# EAGLE schematic LCMeter (EAGLE 6.1)

## Sheet 1 of 4
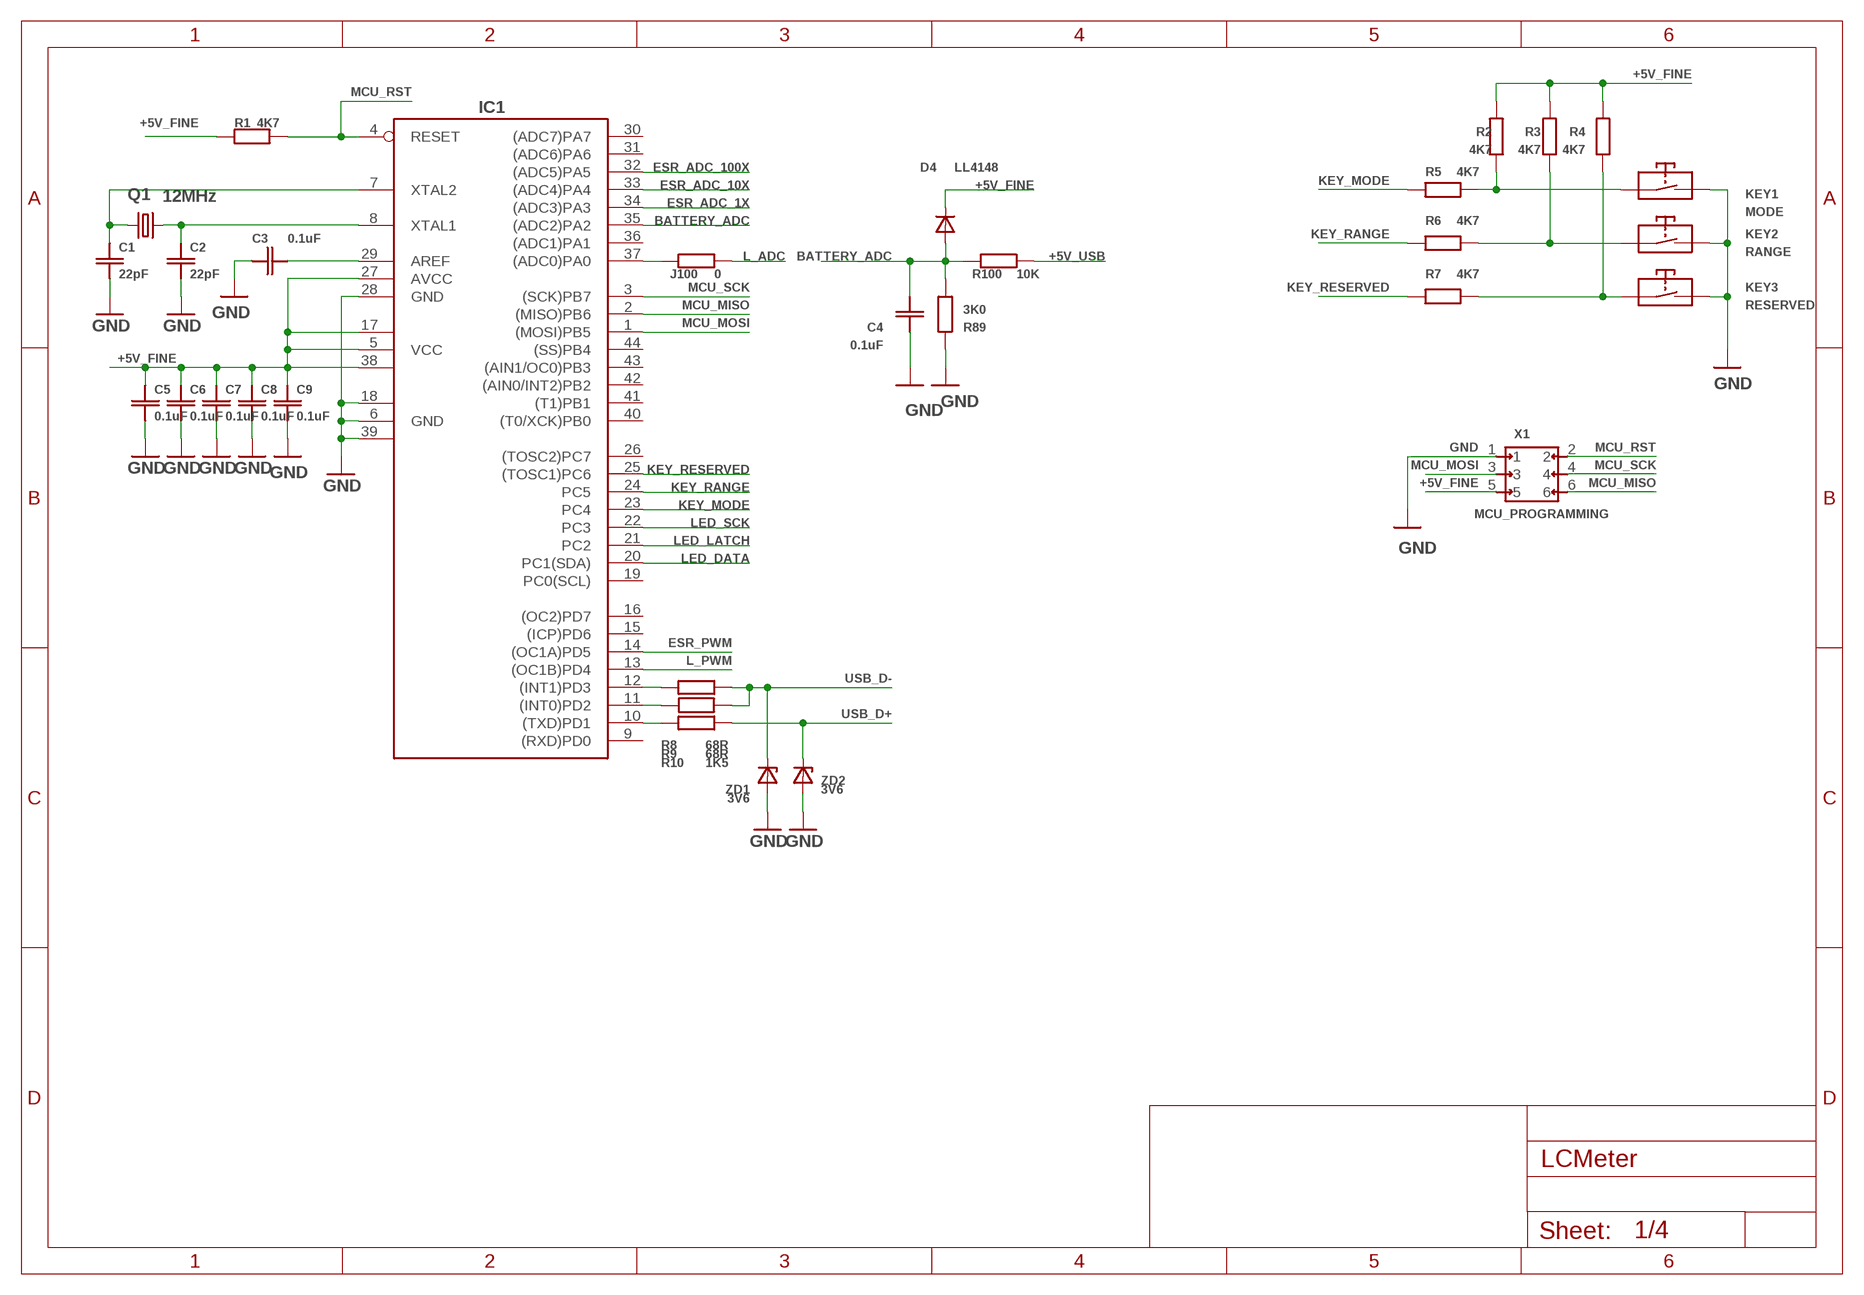
[diagram p0: schematic, sheet 1]

### Parts
C1  22pF  CSMD_0805  [RSMD_0805]
C2  22pF  CSMD_0805  [RSMD_0805]
C3  0.1uF  CSMD_0805  [RSMD_0805]
C4  0.1uF  CSMD_0805  [RSMD_0805]
C5  0.1uF  CSMD_0805  [RSMD_0805]
C6  0.1uF  CSMD_0805  [RSMD_0805]
C7  0.1uF  CSMD_0805  [RSMD_0805]
C8  0.1uF  CSMD_0805  [RSMD_0805]
C9  0.1uF  CSMD_0805  [RSMD_0805]
D4  LL4148  LL4147SOD-80  [SOD-80]
IC1  MEGA8535  MEGA8535-A  [TQFP44]
J100  0  RSMD_1206_BIG_GAP  [RSMD_1206_BIG_GAP]
KEY1  MODE  KEY(7X4.5)  [KEY_7X4.5]
KEY2  RANGE  KEY(7X4.5)  [KEY_7X4.5]
KEY3  RESERVED  KEY(7X4.5)  [KEY_7X4.5]
Q1  12MHz  CRYSTALHC49U-V  [HC49U-V]
R1  4K7  RSMD_0805  [RSMD_0805]
R2  4K7  RSMD_0805  [RSMD_0805]
R3  4K7  RSMD_0805  [RSMD_0805]
R4  4K7  RSMD_0805  [RSMD_0805]
R5  4K7  RSMD_0805  [RSMD_0805]
R6  4K7  RSMD_0805  [RSMD_0805]
R7  4K7  RSMD_0805  [RSMD_0805]
R8  68R  RSMD_0805  [RSMD_0805]
R9  1K5  RSMD_0805  [RSMD_0805]
R10  68R  RSMD_0805  [RSMD_0805]
R89  3K0  RSMD_0805  [RSMD_0805]
R100  10K  RSMD_0805  [RSMD_0805]
X1  MCU_PROGRAMMING  PIN2X32.54MM_LOOSE_PADS  [PIN2X3_2.54MM_LOOSE_PADS]
ZD1  3V6  ZENNER(SOD_80)  [SOD-80]
ZD2  3V6  ZENNER(SOD_80)  [SOD-80]

### Nets
+5V_FINE: C5.PAD_1(PIN1) C6.PAD_1(PIN1) C7.PAD_1(PIN1) C8.PAD_1(PIN1) C9.PAD_1(PIN1) D4.CATHODE IC1.5(VCC) IC1.17(VCC1) IC1.27(AVCC) IC1.38(VCC2) R1.PAD_0(PIN0) R2.PAD_1(PIN1) R3.PAD_1(PIN1) R4.PAD_1(PIN1) X1.5 ; also sheet 3,4
+5V_USB: R100.PAD_0(PIN0) ; also sheet 4
BATTERY_ADC: C4.PAD_1(PIN1) D4.ANODE IC1.35((ADC2)PA2) R89.PAD_0(PIN0) R100.PAD_1(PIN1)
ESR_ADC_1X: IC1.34((ADC3)PA3) ; also sheet 3
ESR_ADC_10X: IC1.33((ADC4)PA4) ; also sheet 3
ESR_ADC_100X: IC1.32((ADC5)PA5) ; also sheet 3
ESR_PWM: IC1.14((OC1A)PD5) ; also sheet 3
GND: C1.PAD_0(PIN0) C2.PAD_0(PIN0) C3.PAD_0(PIN0) C4.PAD_0(PIN0) C5.PAD_0(PIN0) C6.PAD_0(PIN0) C7.PAD_0(PIN0) C8.PAD_0(PIN0) C9.PAD_0(PIN0) IC1.6(GND) IC1.18(GND1) IC1.28(GND) IC1.39(GND2) KEY1.3 KEY1.4 KEY2.3 KEY2.4 KEY3.3 KEY3.4 R89.PAD_1(PIN1) X1.1 ZD1.ANODE ZD2.ANODE ; also sheet 2,3,4
KEY_MODE: IC1.23(PC4) R5.PAD_1(PIN1)
KEY_RANGE: IC1.24(PC5) R6.PAD_1(PIN1)
KEY_RESERVED: IC1.25((TOSC1)PC6) R7.PAD_1(PIN1)
L_ADC: J100.PAD_0(PIN0) ; also sheet 3
L_PWM: IC1.13((OC1B)PD4) ; also sheet 3
LED_DATA: IC1.20(PC1(SDA)) ; also sheet 2
LED_LATCH: IC1.21(PC2) ; also sheet 2
LED_SCK: IC1.22(PC3) ; also sheet 2
MCU_MISO: IC1.2((MISO)PB6) X1.6
MCU_MOSI: IC1.1((MOSI)PB5) X1.3
MCU_RST: IC1.4(RESET) R1.PAD_1(PIN1) X1.2
MCU_SCK: IC1.3((SCK)PB7) X1.4
N$7: IC1.10((TXD)PD1) R10.PAD_0(PIN0)
N$8: IC1.12((INT1)PD3) R8.PAD_1(PIN1)
N$100: IC1.37((ADC0)PA0) J100.PAD_1(PIN1)
N$110: C2.PAD_1(PIN1) IC1.8(XTAL1) Q1.2
N$111: C1.PAD_1(PIN1) IC1.7(XTAL2) Q1.1
N$112: IC1.11((INT0)PD2) R9.PAD_1(PIN1)
N$141: C3.PAD_1(PIN1) IC1.29(AREF)
N$144: KEY1.1 KEY1.2 R2.PAD_0(PIN0) R5.PAD_0(PIN0)
N$145: KEY2.1 KEY2.2 R3.PAD_0(PIN0) R6.PAD_0(PIN0)
N$146: KEY3.1 KEY3.2 R4.PAD_0(PIN0) R7.PAD_0(PIN0)
USB_D+: R10.PAD_1(PIN1) ZD2.CATHODE ; also sheet 4
USB_D-: R8.PAD_0(PIN0) R9.PAD_0(PIN0) ZD1.CATHODE ; also sheet 4
Unconnected: IC1.9((RXD)PD0) IC1.15((ICP)PD6) IC1.16((OC2)PD7) IC1.19(PC0(SCL)) IC1.26((TOSC2)PC7) IC1.30((ADC7)PA7) IC1.31((ADC6)PA6) IC1.36((ADC1)PA1) IC1.40((T0/XCK)PB0) IC1.41((T1)PB1) IC1.42((AIN0/INT2)PB2) IC1.43((AIN1/OC0)PB3) IC1.44((SS)PB4)

## Sheet 2 of 4
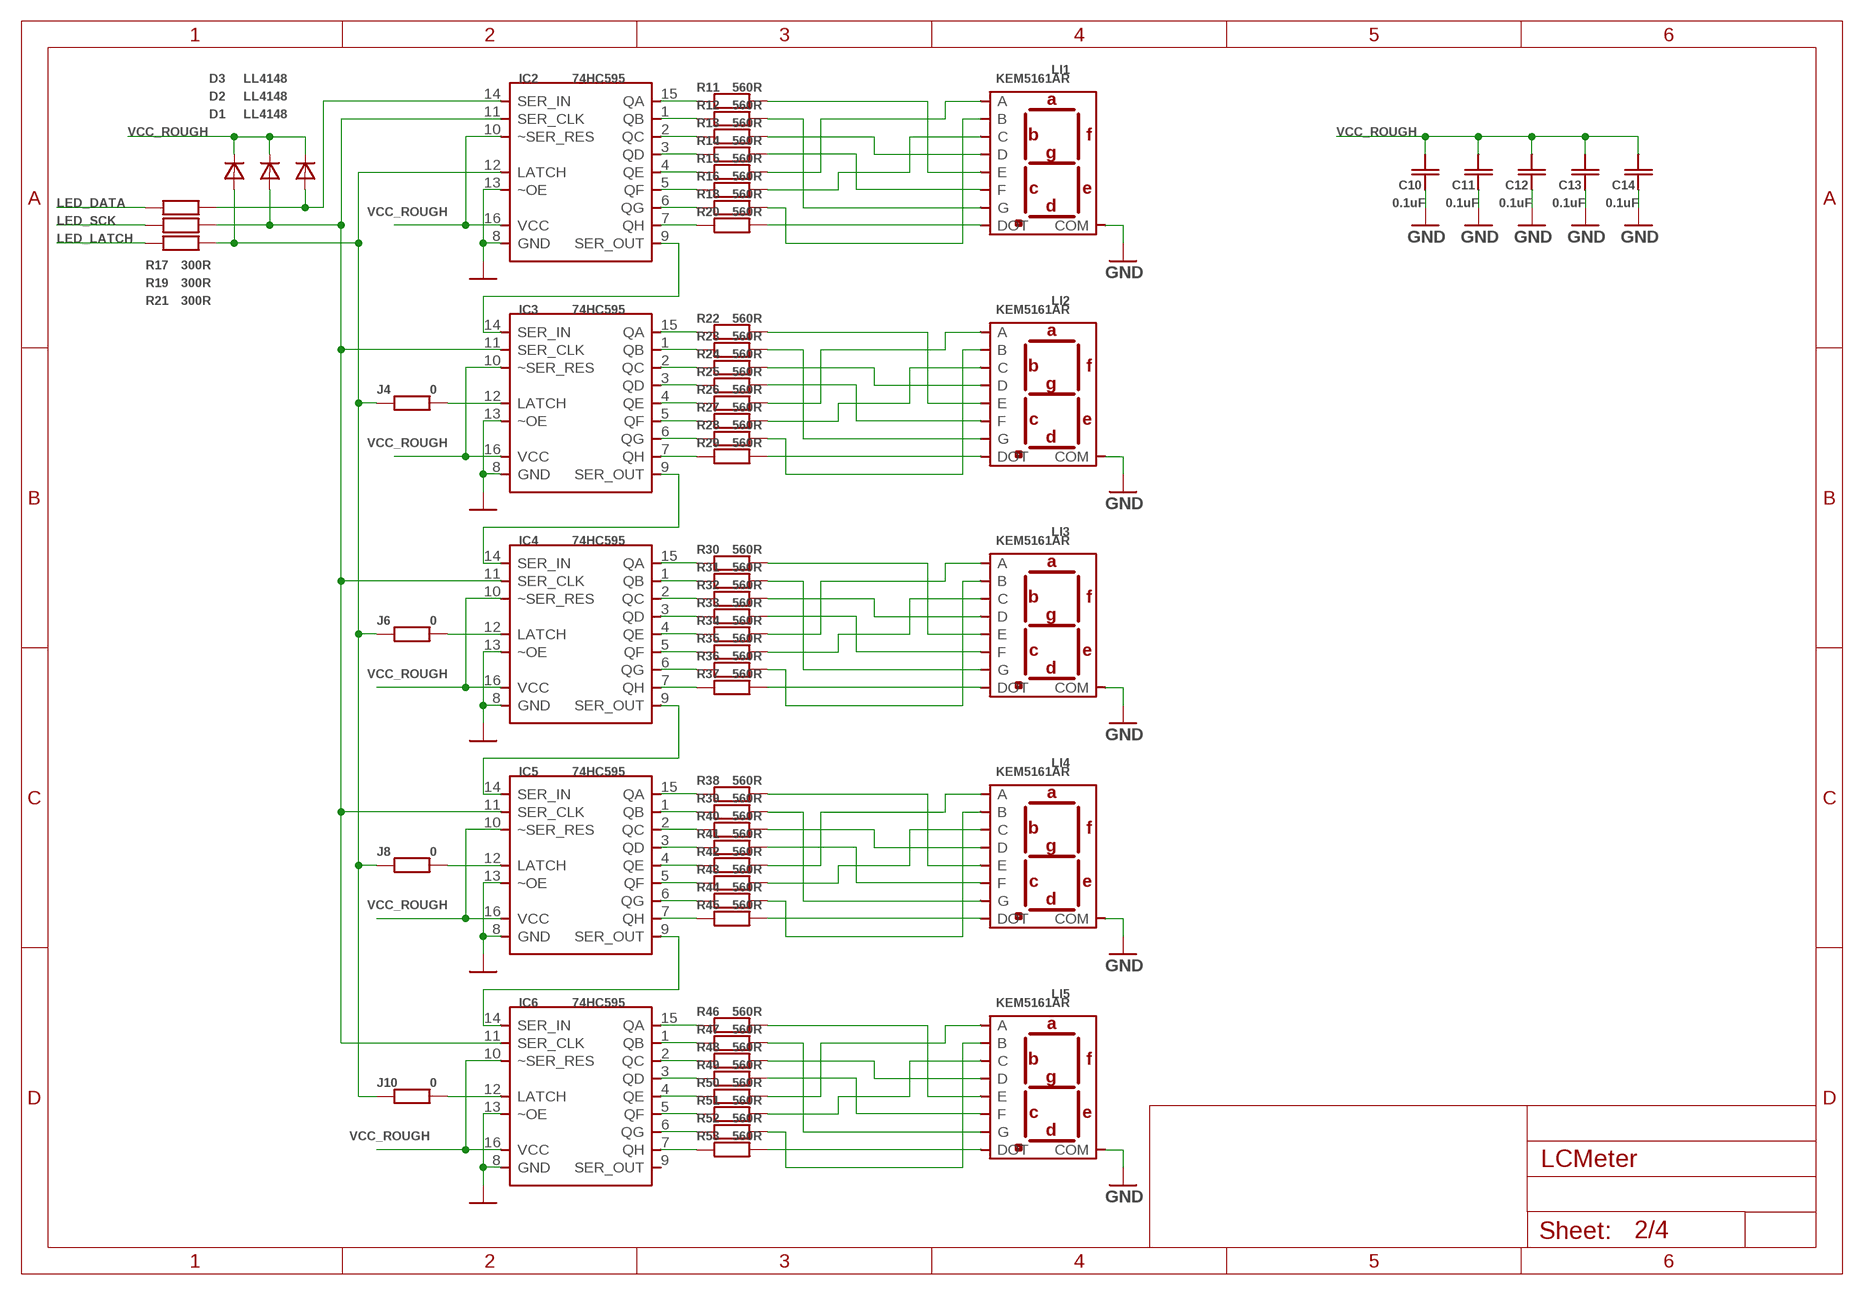
[diagram p1: schematic, sheet 2]

### Parts
C10  0.1uF  CSMD_0805  [RSMD_0805]
C11  0.1uF  CSMD_0805  [RSMD_0805]
C12  0.1uF  CSMD_0805  [RSMD_0805]
C13  0.1uF  CSMD_0805  [RSMD_0805]
C14  0.1uF  CSMD_0805  [RSMD_0805]
D1  LL4148  LL4147SOD-80  [SOD-80]
D2  LL4148  LL4147SOD-80  [SOD-80]
D3  LL4148  LL4147SOD-80  [SOD-80]
IC2  74HC595  74HC595(SOIC16)  [SOIC16]
IC3  74HC595  74HC595(SOIC16)  [SOIC16]
IC4  74HC595  74HC595(SOIC16)  [SOIC16]
IC5  74HC595  74HC595(SOIC16)  [SOIC16]
IC6  74HC595  74HC595(SOIC16)  [SOIC16]
J4  0  RSMD_0805  [RSMD_0805]
J6  0  RSMD_0805  [RSMD_0805]
J8  0  RSMD_0805  [RSMD_0805]
J10  0  RSMD_0805  [RSMD_0805]
LI1  KEM5161AR  KEM5161(NARROW)  [KEM-5161(NARROW)]
LI2  KEM5161AR  KEM5161(NARROW)  [KEM-5161(NARROW)]
LI3  KEM5161AR  KEM5161(NARROW)  [KEM-5161(NARROW)]
LI4  KEM5161AR  KEM5161(NARROW)  [KEM-5161(NARROW)]
LI5  KEM5161AR  KEM5161(NARROW)  [KEM-5161(NARROW)]
R11  560R  RSMD_0805  [RSMD_0805]
R12  560R  RSMD_0805  [RSMD_0805]
R13  560R  RSMD_0805  [RSMD_0805]
R14  560R  RSMD_0805  [RSMD_0805]
R15  560R  RSMD_0805  [RSMD_0805]
R16  560R  RSMD_0805  [RSMD_0805]
R17  300R  RSMD_0805  [RSMD_0805]
R18  560R  RSMD_0805  [RSMD_0805]
R19  300R  RSMD_0805  [RSMD_0805]
R20  560R  RSMD_0805  [RSMD_0805]
R21  300R  RSMD_0805  [RSMD_0805]
R22  560R  RSMD_0805  [RSMD_0805]
R23  560R  RSMD_0805  [RSMD_0805]
R24  560R  RSMD_0805  [RSMD_0805]
R25  560R  RSMD_0805  [RSMD_0805]
R26  560R  RSMD_0805  [RSMD_0805]
R27  560R  RSMD_0805  [RSMD_0805]
R28  560R  RSMD_0805  [RSMD_0805]
R29  560R  RSMD_0805  [RSMD_0805]
R30  560R  RSMD_0805  [RSMD_0805]
R31  560R  RSMD_0805  [RSMD_0805]
R32  560R  RSMD_0805  [RSMD_0805]
R33  560R  RSMD_0805  [RSMD_0805]
R34  560R  RSMD_0805  [RSMD_0805]
R35  560R  RSMD_0805  [RSMD_0805]
R36  560R  RSMD_0805  [RSMD_0805]
R37  560R  RSMD_0805  [RSMD_0805]
R38  560R  RSMD_0805  [RSMD_0805]
R39  560R  RSMD_0805  [RSMD_0805]
R40  560R  RSMD_0805  [RSMD_0805]
R41  560R  RSMD_0805  [RSMD_0805]
R42  560R  RSMD_0805  [RSMD_0805]
R43  560R  RSMD_0805  [RSMD_0805]
R44  560R  RSMD_0805  [RSMD_0805]
R45  560R  RSMD_0805  [RSMD_0805]
R46  560R  RSMD_0805  [RSMD_0805]
R47  560R  RSMD_0805  [RSMD_0805]
R48  560R  RSMD_0805  [RSMD_0805]
R49  560R  RSMD_0805  [RSMD_0805]
R50  560R  RSMD_0805  [RSMD_0805]
R51  560R  RSMD_0805  [RSMD_0805]
R52  560R  RSMD_0805  [RSMD_0805]
R53  560R  RSMD_0805  [RSMD_0805]

### Nets
GND: C10.PAD_0(PIN0) C11.PAD_0(PIN0) C12.PAD_0(PIN0) C13.PAD_0(PIN0) C14.PAD_0(PIN0) IC2.8(GND) IC2.13(~OE) IC3.8(GND) IC3.13(~OE) IC4.8(GND) IC4.13(~OE) IC5.8(GND) IC5.13(~OE) IC6.8(GND) IC6.13(~OE) LI1.3(COM) LI1.8(COM) LI2.3(COM) LI2.8(COM) LI3.3(COM) LI3.8(COM) LI4.3(COM) LI4.8(COM) LI5.3(COM) LI5.8(COM) ; also sheet 1,3,4
LED_DATA: R17.PAD_0(PIN0) ; also sheet 1
LED_DATA': D3.ANODE IC2.14(SER_IN) R17.PAD_1(PIN1)
LED_LATCH: R21.PAD_0(PIN0) ; also sheet 1
LED_LATCH': D1.ANODE IC2.12(LATCH) J4.PAD_0(PIN0) J6.PAD_0(PIN0) J8.PAD_0(PIN0) J10.PAD_0(PIN0) R21.PAD_1(PIN1)
LED_SCK: R19.PAD_0(PIN0) ; also sheet 1
LED_SCK': D2.ANODE IC2.11(SER_CLK) IC3.11(SER_CLK) IC4.11(SER_CLK) IC5.11(SER_CLK) IC6.11(SER_CLK) R19.PAD_1(PIN1)
N$14: IC3.15(QA) R22.PAD_0(PIN0)
N$15: IC3.1(QB) R23.PAD_0(PIN0)
N$16: IC3.2(QC) R24.PAD_0(PIN0)
N$17: IC3.3(QD) R25.PAD_0(PIN0)
N$18: IC3.4(QE) R26.PAD_0(PIN0)
N$19: LI1.1(E) R11.PAD_1(PIN1)
N$20: LI1.2(D) R13.PAD_1(PIN1)
N$21: LI1.4(C) R16.PAD_1(PIN1)
N$22: IC3.5(QF) R27.PAD_0(PIN0)
N$23: LI1.5(DOT) R20.PAD_1(PIN1)
N$24: LI1.10(G) R12.PAD_1(PIN1)
N$26: IC3.6(QG) R28.PAD_0(PIN0)
N$27: LI1.9(F) R14.PAD_1(PIN1)
N$28: LI1.7(A) R15.PAD_1(PIN1)
N$29: LI1.6(B) R18.PAD_1(PIN1)
N$30: IC2.15(QA) R11.PAD_0(PIN0)
N$31: IC2.1(QB) R12.PAD_0(PIN0)
N$32: IC2.2(QC) R13.PAD_0(PIN0)
N$33: IC2.3(QD) R14.PAD_0(PIN0)
N$34: IC2.4(QE) R15.PAD_0(PIN0)
N$35: IC2.5(QF) R16.PAD_0(PIN0)
N$36: IC2.6(QG) R18.PAD_0(PIN0)
N$37: IC2.7(QH) R20.PAD_0(PIN0)
N$38: IC3.7(QH) R29.PAD_0(PIN0)
N$40: LI2.1(E) R22.PAD_1(PIN1)
N$41: LI2.2(D) R24.PAD_1(PIN1)
N$42: LI2.4(C) R27.PAD_1(PIN1)
N$43: LI2.5(DOT) R29.PAD_1(PIN1)
N$44: LI2.10(G) R23.PAD_1(PIN1)
N$45: LI2.9(F) R25.PAD_1(PIN1)
N$46: LI2.7(A) R26.PAD_1(PIN1)
N$47: LI2.6(B) R28.PAD_1(PIN1)
N$48: IC4.15(QA) R30.PAD_0(PIN0)
N$49: IC4.1(QB) R31.PAD_0(PIN0)
N$50: IC4.2(QC) R32.PAD_0(PIN0)
N$51: IC4.3(QD) R33.PAD_0(PIN0)
N$52: IC4.4(QE) R34.PAD_0(PIN0)
N$53: IC4.5(QF) R35.PAD_0(PIN0)
N$54: IC4.6(QG) R36.PAD_0(PIN0)
N$55: IC4.7(QH) R37.PAD_0(PIN0)
N$56: LI3.1(E) R30.PAD_1(PIN1)
N$57: LI3.2(D) R32.PAD_1(PIN1)
N$58: LI3.4(C) R35.PAD_1(PIN1)
N$59: LI3.5(DOT) R37.PAD_1(PIN1)
N$60: LI3.10(G) R31.PAD_1(PIN1)
N$61: LI3.9(F) R33.PAD_1(PIN1)
N$62: LI3.7(A) R34.PAD_1(PIN1)
N$63: LI3.6(B) R36.PAD_1(PIN1)
N$64: IC5.15(QA) R38.PAD_0(PIN0)
N$65: IC5.1(QB) R39.PAD_0(PIN0)
N$66: IC5.2(QC) R40.PAD_0(PIN0)
N$67: IC5.3(QD) R41.PAD_0(PIN0)
N$68: IC5.4(QE) R42.PAD_0(PIN0)
N$69: IC5.5(QF) R43.PAD_0(PIN0)
N$70: IC5.6(QG) R44.PAD_0(PIN0)
N$71: IC5.7(QH) R45.PAD_0(PIN0)
N$72: LI4.1(E) R38.PAD_1(PIN1)
N$73: LI4.2(D) R40.PAD_1(PIN1)
N$74: LI4.4(C) R43.PAD_1(PIN1)
N$75: LI4.5(DOT) R45.PAD_1(PIN1)
N$76: LI4.10(G) R39.PAD_1(PIN1)
N$77: LI4.9(F) R41.PAD_1(PIN1)
N$78: LI4.7(A) R42.PAD_1(PIN1)
N$79: LI4.6(B) R44.PAD_1(PIN1)
N$80: IC6.15(QA) R46.PAD_0(PIN0)
N$81: IC6.1(QB) R47.PAD_0(PIN0)
N$82: IC6.2(QC) R48.PAD_0(PIN0)
N$83: IC6.3(QD) R49.PAD_0(PIN0)
N$84: IC6.4(QE) R50.PAD_0(PIN0)
N$85: IC6.5(QF) R51.PAD_0(PIN0)
N$86: IC6.6(QG) R52.PAD_0(PIN0)
N$87: IC6.7(QH) R53.PAD_0(PIN0)
N$88: LI5.1(E) R46.PAD_1(PIN1)
N$89: LI5.2(D) R48.PAD_1(PIN1)
N$90: LI5.4(C) R51.PAD_1(PIN1)
N$91: LI5.5(DOT) R53.PAD_1(PIN1)
N$92: LI5.10(G) R47.PAD_1(PIN1)
N$93: LI5.9(F) R49.PAD_1(PIN1)
N$94: LI5.7(A) R50.PAD_1(PIN1)
N$95: LI5.6(B) R52.PAD_1(PIN1)
N$96: IC4.9(SER_OUT) IC5.14(SER_IN)
N$97: IC3.9(SER_OUT) IC4.14(SER_IN)
N$98: IC2.9(SER_OUT) IC3.14(SER_IN)
N$99: IC5.9(SER_OUT) IC6.14(SER_IN)
N$103: IC3.12(LATCH) J4.PAD_1(PIN1)
N$107: IC6.12(LATCH) J10.PAD_1(PIN1)
N$108: IC5.12(LATCH) J8.PAD_1(PIN1)
N$109: IC4.12(LATCH) J6.PAD_1(PIN1)
VCC_ROUGH: C10.PAD_1(PIN1) C11.PAD_1(PIN1) C12.PAD_1(PIN1) C13.PAD_1(PIN1) C14.PAD_1(PIN1) D1.CATHODE D2.CATHODE D3.CATHODE IC2.10(~SER_RES) IC2.16(VCC) IC3.10(~SER_RES) IC3.16(VCC) IC4.10(~SER_RES) IC4.16(VCC) IC5.10(~SER_RES) IC5.16(VCC) IC6.10(~SER_RES) IC6.16(VCC) ; also sheet 4
Unconnected: IC6.9(SER_OUT)

## Sheet 3 of 4
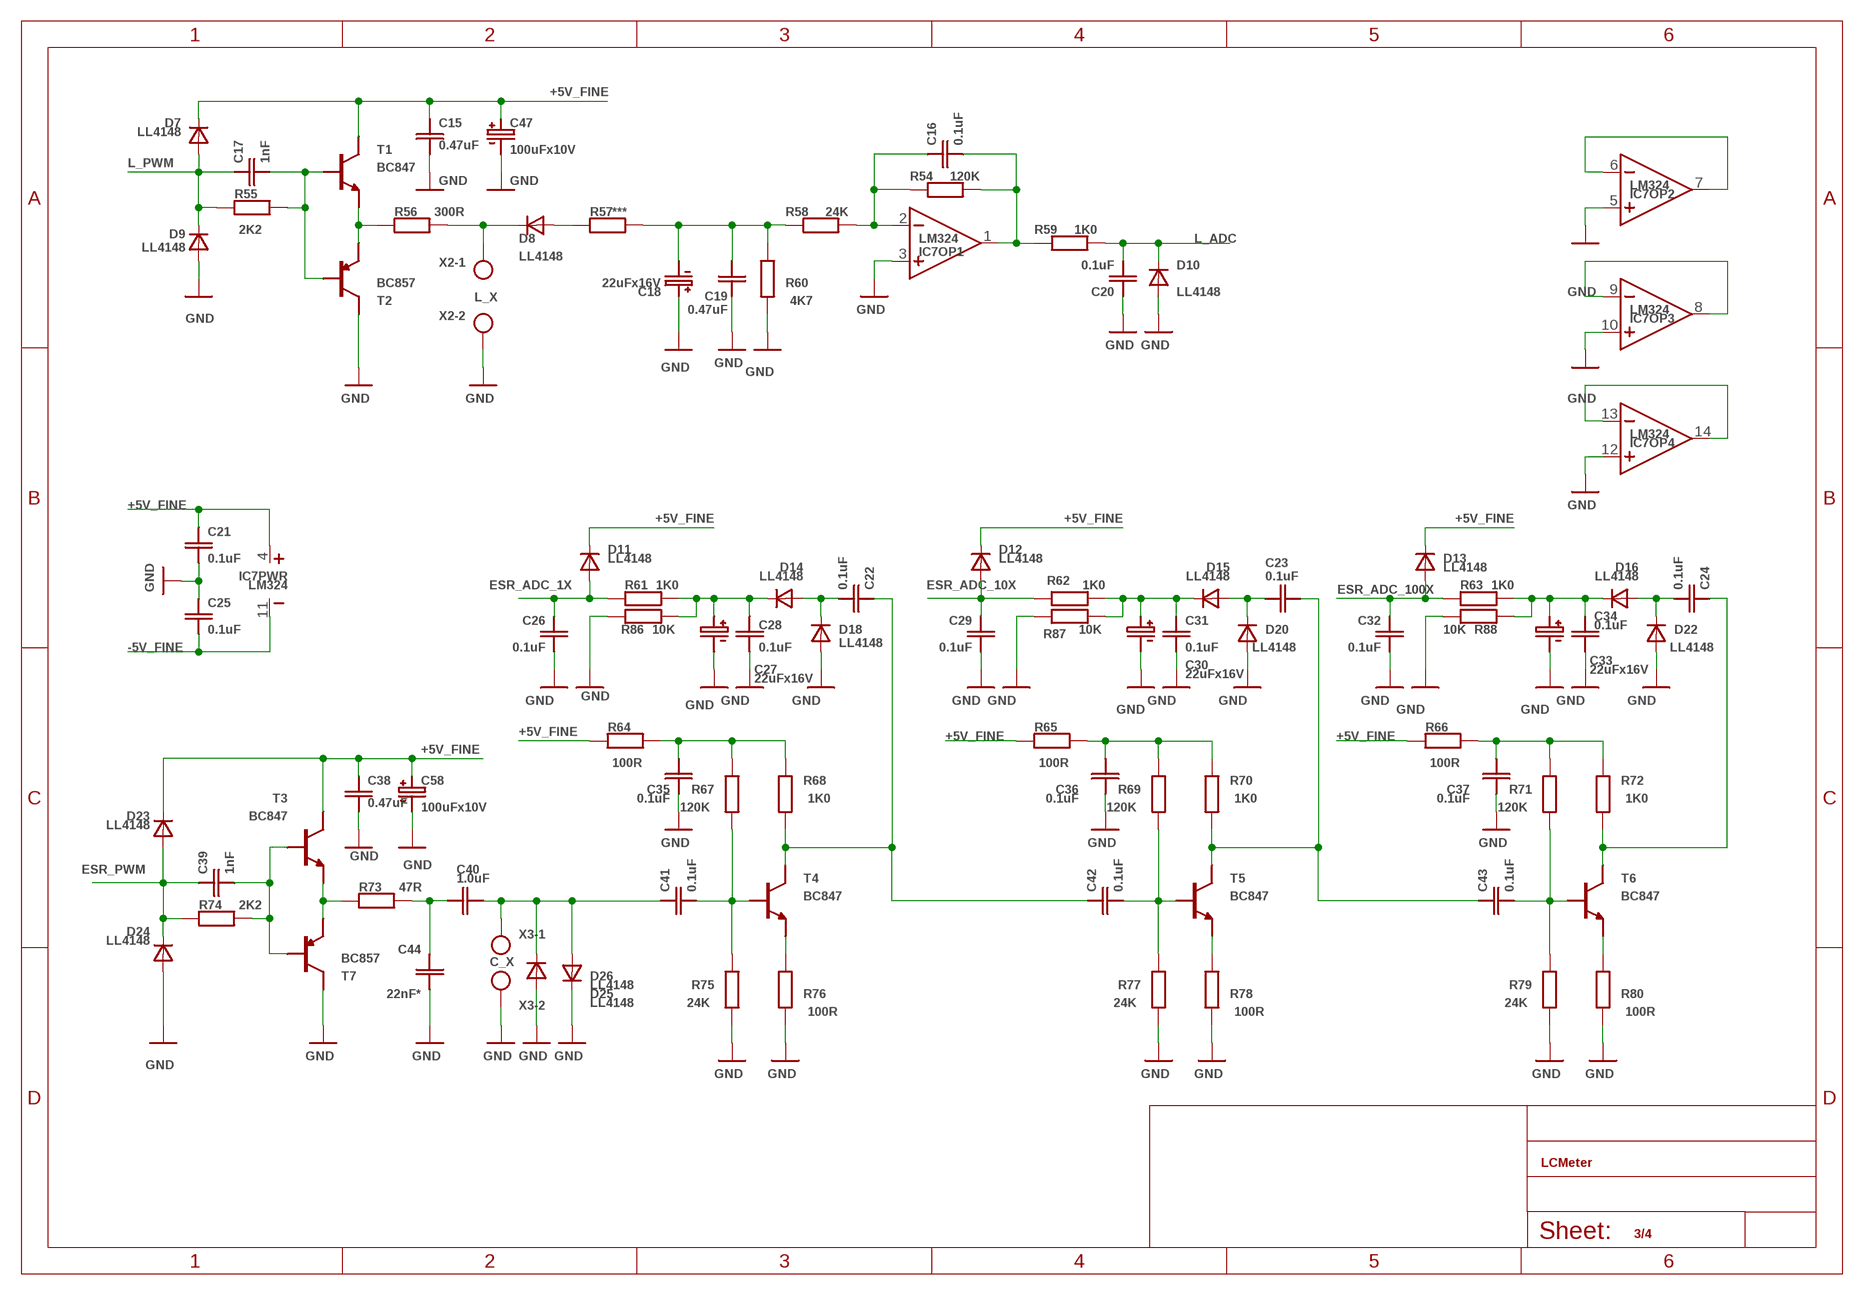
[diagram p2: schematic, sheet 3]

### Parts
C15  0.47uF  CSMD_0805  [RSMD_0805]
C16  0.1uF  CSMD_0805  [RSMD_0805]
C17  1nF  CSMD_0805  [RSMD_0805]
C18  22uFx16V  CE6.3MM  [CE_6.3MM]
C19  0.47uF  CSMD_1206_BIG_GAP  [RSMD_1206_BIG_GAP]
C20  0.1uF  CSMD_0805  [RSMD_0805]
C21  0.1uF  CSMD_0805  [RSMD_0805]
C22  0.1uF  CSMD_0805  [RSMD_0805]
C23  0.1uF  CSMD_0805  [RSMD_0805]
C24  0.1uF  CSMD_0805  [RSMD_0805]
C25  0.1uF  CSMD_0805  [RSMD_0805]
C26  0.1uF  CSMD_0805  [RSMD_0805]
C27  22uFx16V  CE6.3MM  [CE_6.3MM]
C28  0.1uF  CSMD_0805  [RSMD_0805]
C29  0.1uF  CSMD_0805  [RSMD_0805]
C30  22uFx16V  CE6.3MM  [CE_6.3MM]
C31  0.1uF  CSMD_0805  [RSMD_0805]
C32  0.1uF  CSMD_0805  [RSMD_0805]
C33  22uFx16V  CE6.3MM  [CE_6.3MM]
C34  0.1uF  CSMD_0805  [RSMD_0805]
C35  0.1uF  CSMD_0805  [RSMD_0805]
C36  0.1uF  CSMD_0805  [RSMD_0805]
C37  0.1uF  CSMD_0805  [RSMD_0805]
C38  0.47uF  CSMD_0805  [RSMD_0805]
C39  1nF  CSMD_0805  [RSMD_0805]
C40  1.0uF  CSMD_1206_BIG_GAP  [RSMD_1206_BIG_GAP]
C41  0.1uF  CSMD_0805  [RSMD_0805]
C42  0.1uF  CSMD_0805  [RSMD_0805]
C43  0.1uF  CSMD_0805  [RSMD_0805]
C44  22nF*  CSMD_0805  [RSMD_0805]
C47  100uFx10V  CE6.3MM  [CE_6.3MM]
C58  100uFx10V  CE6.3MM  [CE_6.3MM]
D7  LL4148  LL4147SOD-80  [SOD-80]
D8  LL4148  LL4147SOD-80  [SOD-80]
D9  LL4148  LL4147SOD-80  [SOD-80]
D10  LL4148  LL4147SOD-80  [SOD-80]
D11  LL4148  LL4147SOD-80  [SOD-80]
D12  LL4148  LL4147SOD-80  [SOD-80]
D13  LL4148  LL4147SOD-80  [SOD-80]
D14  LL4148  LL4147SOD-80  [SOD-80]
D15  LL4148  LL4147SOD-80  [SOD-80]
D16  LL4148  LL4147SOD-80  [SOD-80]
D18  LL4148  LL4147SOD-80  [SOD-80]
D20  LL4148  LL4147SOD-80  [SOD-80]
D22  LL4148  LL4147SOD-80  [SOD-80]
D23  LL4148  LL4147SOD-80  [SOD-80]
D24  LL4148  LL4147SOD-80  [SOD-80]
D25  LL4148  LL4147SOD-80  [SOD-80]
D26  LL4148  LL4147SOD-80  [SOD-80]
IC7  LM324  [SOIC14]
R54  120K  RSMD_0805  [RSMD_0805]
R55  2K2  RSMD_0805  [RSMD_0805]
R56  300R  RSMD_1206_BIG_GAP  [RSMD_1206_BIG_GAP]
R57  ***  RSMD_1206_BIG_GAP  [RSMD_1206_BIG_GAP]
R58  24K  RSMD_0805  [RSMD_0805]
R59  1K0  RSMD_1206_BIG_GAP  [RSMD_1206_BIG_GAP]
R60  4K7  RSMD_0805  [RSMD_0805]
R61  1K0  RSMD_0805  [RSMD_0805]
R62  1K0  RSMD_0805  [RSMD_0805]
R63  1K0  RSMD_0805  [RSMD_0805]
R64  100R  RSMD_0805  [RSMD_0805]
R65  100R  RSMD_0805  [RSMD_0805]
R66  100R  RSMD_0805  [RSMD_0805]
R67  120K  RSMD_0805  [RSMD_0805]
R68  1K0  RSMD_0805  [RSMD_0805]
R69  120K  RSMD_0805  [RSMD_0805]
R70  1K0  RSMD_0805  [RSMD_0805]
R71  120K  RSMD_0805  [RSMD_0805]
R72  1K0  RSMD_0805  [RSMD_0805]
R73  47R  RSMD_1206_BIG_GAP  [RSMD_1206_BIG_GAP]
R74  2K2  RSMD_0805  [RSMD_0805]
R75  24K  RSMD_0805  [RSMD_0805]
R76  100R  RSMD_0805  [RSMD_0805]
R77  24K  RSMD_0805  [RSMD_0805]
R78  100R  RSMD_0805  [RSMD_0805]
R79  24K  RSMD_0805  [RSMD_0805]
R80  100R  RSMD_0805  [RSMD_0805]
R86  10K  RSMD_0805  [RSMD_0805]
R87  10K  RSMD_0805  [RSMD_0805]
R88  10K  RSMD_0805  [RSMD_0805]
T1  BC847  BC847SOT23_SMALL_PADS  [SOT23_SMALL_PADS]
T2  BC857  BC857SOT23_SMALL_PADS  [SOT23_SMALL_PADS]
T3  BC847  BC847SOT23_SMALL_PADS  [SOT23_SMALL_PADS]
T4  BC847  BC847SOT23_SMALL_PADS  [SOT23_SMALL_PADS]
T5  BC847  BC847SOT23_SMALL_PADS  [SOT23_SMALL_PADS]
T6  BC847  BC847SOT23_SMALL_PADS  [SOT23_SMALL_PADS]
T7  BC857  BC857SOT23_SMALL_PADS  [SOT23_SMALL_PADS]
X2  L_X  W237-102  [W237-102]
X3  C_X  W237-102  [W237-102]

### Nets
+5V_FINE: C15.PAD_0(PIN0) C21.PAD_1(PIN1) C38.PAD_0(PIN0) C47.+ C58.+ D7.CATHODE D11.CATHODE D12.CATHODE D13.CATHODE D23.CATHODE IC7.4(PWR:VCC) R64.PAD_0(PIN0) R65.PAD_0(PIN0) R66.PAD_0(PIN0) T1.3(C) T3.3(C) ; also sheet 1,4
-5V_FINE: C25.PAD_0(PIN0) IC7.11(PWR:GND) ; also sheet 4
ESR_ADC_1X: C26.PAD_1(PIN1) D11.ANODE R61.PAD_1(PIN1) ; also sheet 1
ESR_ADC_10X: C29.PAD_1(PIN1) D12.ANODE R62.PAD_1(PIN1) ; also sheet 1
ESR_ADC_100X: C32.PAD_1(PIN1) D13.ANODE R63.PAD_1(PIN1) ; also sheet 1
ESR_PWM: C39.PAD_1(PIN1) D23.ANODE D24.CATHODE R74.PAD_0(PIN0) ; also sheet 1
GND: C15.PAD_1(PIN1) C18.+ C19.PAD_0(PIN0) C20.PAD_1(PIN1) C21.PAD_0(PIN0) C25.PAD_1(PIN1) C26.PAD_0(PIN0) C27.- C28.PAD_0(PIN0) C29.PAD_0(PIN0) C30.- C31.PAD_0(PIN0) C32.PAD_0(PIN0) C33.- C34.PAD_0(PIN0) C35.PAD_1(PIN1) C36.PAD_1(PIN1) C37.PAD_1(PIN1) C38.PAD_1(PIN1) C44.PAD_0(PIN0) C47.- C58.- D9.ANODE D10.ANODE D18.ANODE D20.ANODE D22.ANODE D24.ANODE D25.ANODE D26.CATHODE IC7.3(OP1:IN+) IC7.5(OP2:IN+) IC7.10(OP3:IN+) IC7.12(OP4:IN+) R60.PAD_1(PIN1) R75.PAD_0(PIN0) R76.PAD_0(PIN0) R77.PAD_0(PIN0) R78.PAD_0(PIN0) R79.PAD_0(PIN0) R80.PAD_0(PIN0) R86.PAD_0(PIN0) R87.PAD_0(PIN0) R88.PAD_0(PIN0) T2.3(C) T7.3(C) X2.2 X3.2 ; also sheet 1,2,4
L_ADC: C20.PAD_0(PIN0) D10.CATHODE R59.PAD_1(PIN1) ; also sheet 1
L_PWM: C17.PAD_1(PIN1) D7.ANODE D9.CATHODE R55.PAD_0(PIN0) ; also sheet 1
N$1: IC7.13(OP4:IN-) IC7.14(OP4:OUT)
N$2: IC7.8(OP3:OUT) IC7.9(OP3:IN-)
N$3: IC7.6(OP2:IN-) IC7.7(OP2:OUT)
N$4: C16.PAD_1(PIN1) IC7.2(OP1:IN-) R54.PAD_0(PIN0) R58.PAD_1(PIN1)
N$5: C16.PAD_0(PIN0) IC7.1(OP1:OUT) R54.PAD_1(PIN1) R59.PAD_0(PIN0)
N$6: C39.PAD_0(PIN0) R74.PAD_1(PIN1) T3.1(B) T7.1(B)
N$9: C17.PAD_0(PIN0) R55.PAD_1(PIN1) T1.1(B) T2.1(B)
N$11: R56.PAD_0(PIN0) T1.2(E) T2.2(E)
N$12: D8.CATHODE R56.PAD_1(PIN1) X2.1
N$13: D8.ANODE R57.PAD_0(PIN0)
N$25: C18.- C19.PAD_1(PIN1) R57.PAD_1(PIN1) R58.PAD_0(PIN0) R60.PAD_0(PIN0)
N$39: R73.PAD_0(PIN0) T3.2(E) T7.2(E)
N$113: C40.PAD_1(PIN1) C44.PAD_1(PIN1) R73.PAD_1(PIN1)
N$114: C40.PAD_0(PIN0) C41.PAD_1(PIN1) D25.CATHODE D26.ANODE X3.1
N$115: C41.PAD_0(PIN0) R67.PAD_0(PIN0) R75.PAD_1(PIN1) T4.1(B)
N$116: C22.PAD_1(PIN1) C42.PAD_1(PIN1) R68.PAD_0(PIN0) T4.3(C)
N$117: R76.PAD_1(PIN1) T4.2(E)
N$118: C42.PAD_0(PIN0) R69.PAD_0(PIN0) R77.PAD_1(PIN1) T5.1(B)
N$119: C23.PAD_1(PIN1) C43.PAD_1(PIN1) R70.PAD_0(PIN0) T5.3(C)
N$120: R78.PAD_1(PIN1) T5.2(E)
N$121: C43.PAD_0(PIN0) R71.PAD_0(PIN0) R79.PAD_1(PIN1) T6.1(B)
N$122: C24.PAD_1(PIN1) R72.PAD_0(PIN0) T6.3(C)
N$123: R80.PAD_1(PIN1) T6.2(E)
N$124: C27.+ C28.PAD_1(PIN1) D14.CATHODE R61.PAD_0(PIN0) R86.PAD_1(PIN1)
N$125: C22.PAD_0(PIN0) D14.ANODE D18.CATHODE
N$126: C35.PAD_0(PIN0) R64.PAD_1(PIN1) R67.PAD_1(PIN1) R68.PAD_1(PIN1)
N$127: C30.+ C31.PAD_1(PIN1) D15.CATHODE R62.PAD_0(PIN0) R87.PAD_1(PIN1)
N$128: C23.PAD_0(PIN0) D15.ANODE D20.CATHODE
N$129: C36.PAD_0(PIN0) R65.PAD_1(PIN1) R69.PAD_1(PIN1) R70.PAD_1(PIN1)
N$130: C33.+ C34.PAD_1(PIN1) D16.CATHODE R63.PAD_0(PIN0) R88.PAD_1(PIN1)
N$131: C24.PAD_0(PIN0) D16.ANODE D22.CATHODE
N$134: C37.PAD_0(PIN0) R66.PAD_1(PIN1) R71.PAD_1(PIN1) R72.PAD_1(PIN1)

## Sheet 4 of 4
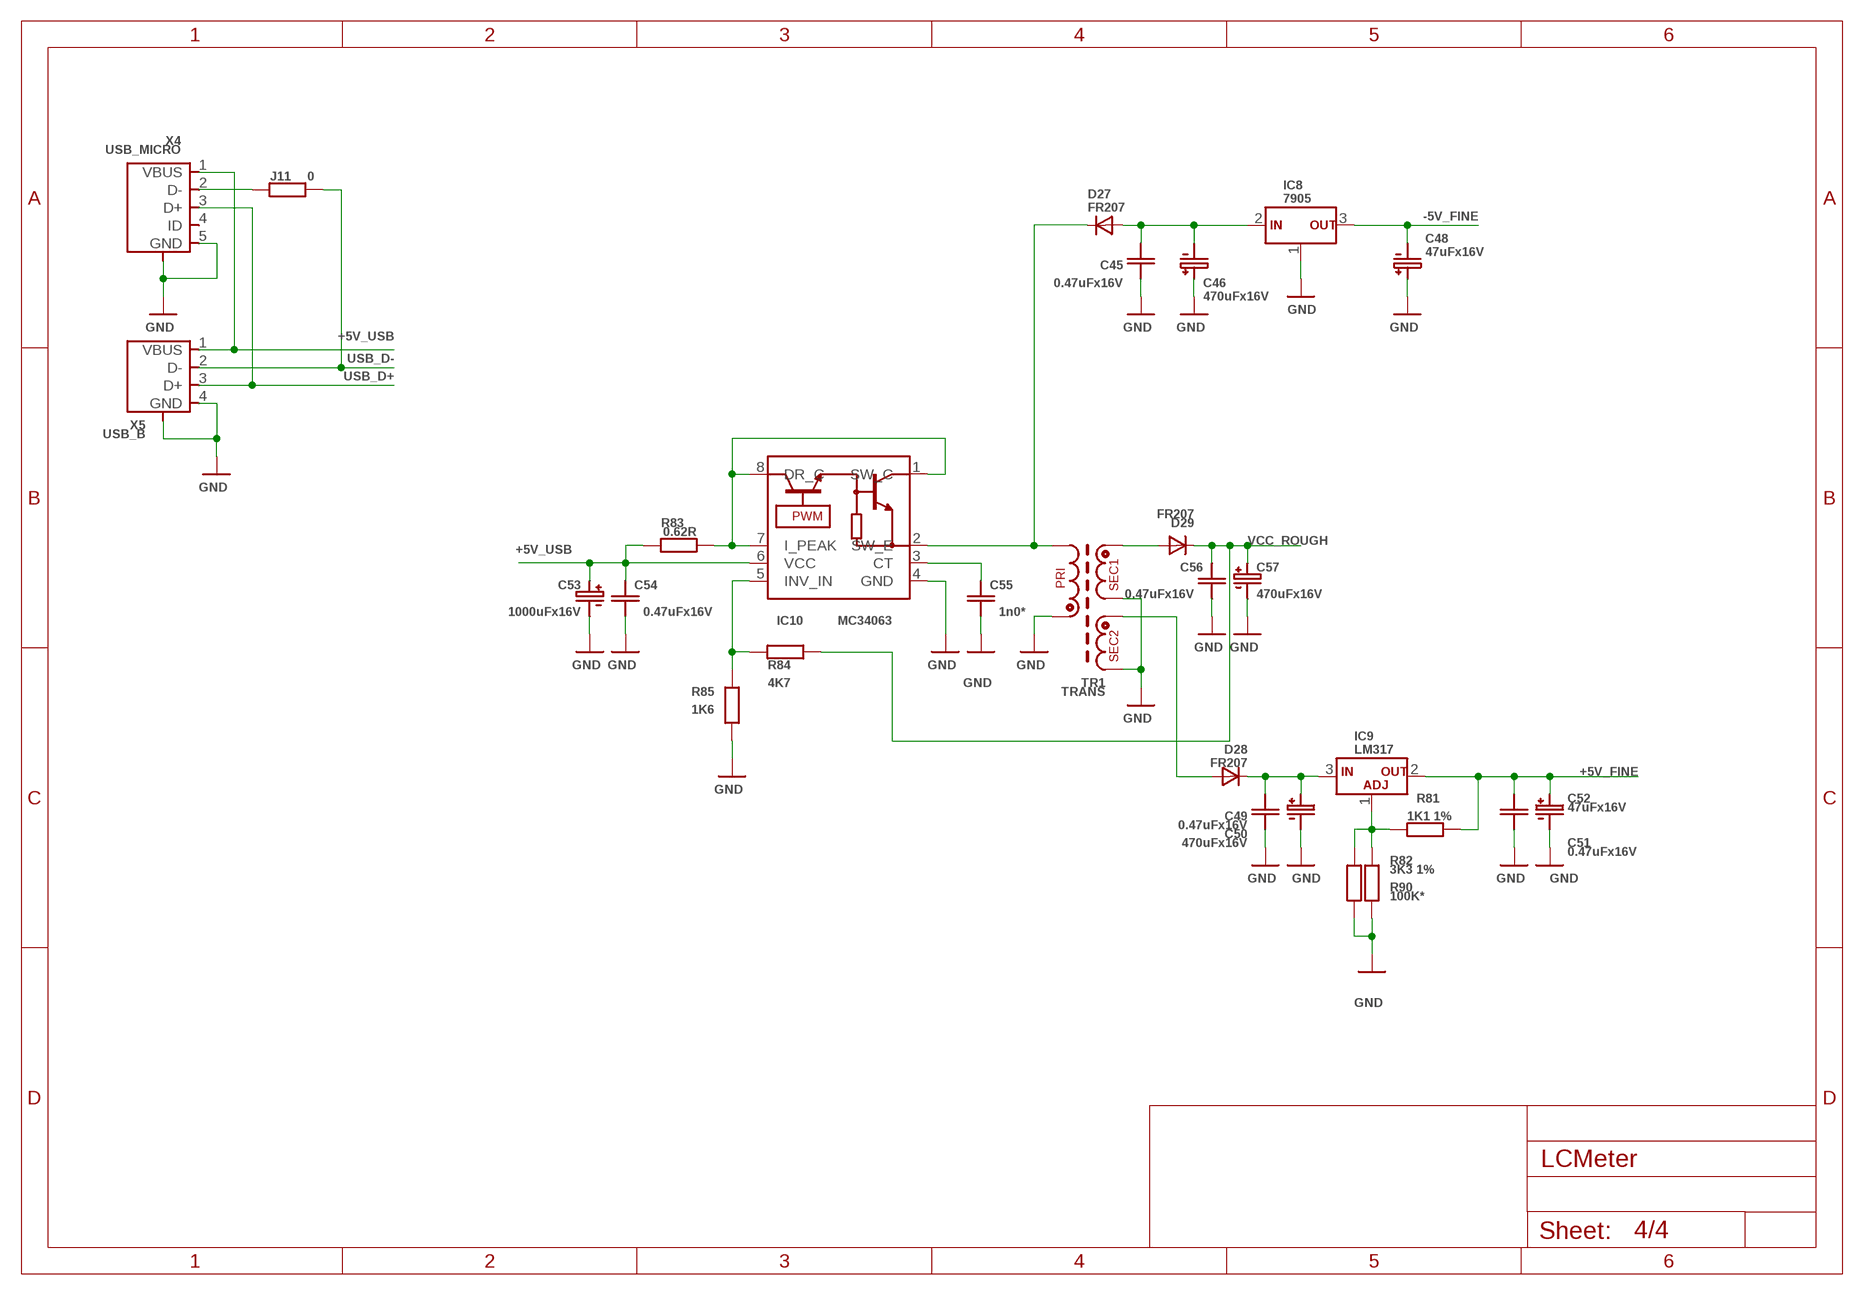
[diagram p3: schematic, sheet 4]

### Parts
C45  0.47uFx16V  CSMD_0805  [RSMD_0805]
C46  470uFx16V  CE10MM  [CE_10MM]
C48  47uFx16V  CE6.3MM  [CE_6.3MM]
C49  0.47uFx16V  CSMD_1206  [RSMD_1206]
C50  470uFx16V  CE10MM  [CE_10MM]
C51  0.47uFx16V  CSMD_0805  [RSMD_0805]
C52  47uFx16V  CE10MM  [CE_10MM]
C53  1000uFx16V  CE10MM  [CE_10MM]
C54  0.47uFx16V  CSMD_1206  [RSMD_1206]
C55  1n0*  CSMD_0805  [RSMD_0805]
C56  0.47uFx16V  CSMD_1206_BIG_GAP  [RSMD_1206_BIG_GAP]
C57  470uFx16V  CE10MM  [CE_10MM]
D27  FR207  1N4001DO-41_10MM  [DO-41_10MM]
D28  FR207  1N4001DO-41_12.5MM  [DO-41_12.5MM]
D29  FR207  1N4001DO-41_5MM  [DO-41_5MM]
IC8  7905  7905(D2PAK)  [D2PAK]
IC9  LM317  LM317(D2PAK)  [D2PAK]
IC10  MC34063  MC34063(SO-8)  [SOIC8]
J11  0  RSMD_0805  [RSMD_0805]
R81  1K1 1%  RSMD_0805  [RSMD_0805]
R82  3K3 1%  RSMD_0805  [RSMD_0805]
R83  0.62R  RSMD_1206_BIG_GAP  [RSMD_1206_BIG_GAP]
R84  4K7  R0207  [R0207]
R85  1K6  RSMD_0805  [RSMD_0805]
R90  100K*  RSMD_0805  [RSMD_0805]
TR1  TRANS  TRANS_3WINDRING25X10_HOR  [RING_25X10_3WIND_HOR]
X4  USB_MICRO  USB_MICROMICRO  [USB_MICRO_TYPE_B]
X5  USB_B  USB_TYPE_B(TYPE_B_SMALL_PADS)  [USB_TYPE_B_SMALL_PADS]

### Nets
+5V_FINE: C51.PAD_1(PIN1) C52.+ IC9.2(OUT) R81.PAD_0(PIN0) ; also sheet 1,3
+5V_USB: C53.+ C54.PAD_1(PIN1) IC10.6(VCC) R83.PAD_0(PIN0) X4.1(VBUS) X5.1(VBUS) ; also sheet 1
-5V_FINE: C48.- IC8.3(OUT) ; also sheet 3
GND: C45.PAD_0(PIN0) C46.+ C48.+ C49.PAD_0(PIN0) C50.- C51.PAD_0(PIN0) C52.- C53.- C54.PAD_0(PIN0) C55.PAD_0(PIN0) C56.PAD_0(PIN0) C57.- IC8.1(GND) IC10.4(GND) R82.PAD_0(PIN0) R85.PAD_0(PIN0) R90.PAD_0(PIN0) TR1.W1_START(PRI_START) TR1.W2_END(SEC1_END) TR1.W3_END(SEC2_END) X4.5(GND) X4.PACKAGE1(PACKAGE) X4.PACKAGE2(PACKAGE) X4.PACKAGE3(PACKAGE) X4.PACKAGE4(PACKAGE) X4.PACKAGE5(PACKAGE) X5.4(GND) X5.PACKAGE_PAD1(PACKAGE) X5.PACKAGE_PAD2(PACKAGE) ; also sheet 1,2,3
N$10: D27.CATHODE IC10.2(SW_E) TR1.W1_END(PRI_END)
N$101: J11.PAD_0(PIN0) X4.2(D-)
N$133: IC10.1(SW_C) IC10.7(I_PEAK) IC10.8(DR_C) R83.PAD_1(PIN1)
N$135: C55.PAD_1(PIN1) IC10.3(CT)
N$136: D29.ANODE TR1.W2_START(SEC1_START)
N$137: C45.PAD_1(PIN1) C46.- D27.ANODE IC8.2(IN)
N$138: D28.ANODE TR1.W3_START(SEC2_START)
N$139: IC10.5(INV_IN) R84.PAD_0(PIN0) R85.PAD_1(PIN1)
N$140: C49.PAD_1(PIN1) C50.+ D28.CATHODE IC9.3(IN)
N$142: IC9.1(ADJ) R81.PAD_1(PIN1) R82.PAD_1(PIN1) R90.PAD_1(PIN1)
USB_D+: X4.3(D+) X5.3(D+) ; also sheet 1
USB_D-: J11.PAD_1(PIN1) X5.2(D-) ; also sheet 1
VCC_ROUGH: C56.PAD_1(PIN1) C57.+ D29.CATHODE R84.PAD1(PIN1) ; also sheet 2
Unconnected: X4.4(ID)

## Library data of the parts
C1-C17 C19-C26 C28 C29 C31 C32 C34-C45 C49 C51 C54-C56 = __MyCommonLib1:C
C18 C27 C30 C33 C46-C48 C50 C52 C53 C57 C58 = __MyCommonLib1:CE
D1-D4 D7-D16 D18 D20 D22-D26 = __MyCommonLib1:LL4147
D27-D29 = __MyCommonLib1:1N4001
IC1 = atmel:MEGA8535: MICROCONTROLLER 8 Kbytes FLASH 512 bytes SRAM 512 bytes EEPROM USART 8-channel 10 bit ADC Source: avr.lbr; MPN: ATMEGA8535-16AU; OC_FARNELL: 1528437; OC_NEWARK: 01M6908
IC2-IC6 = __MyCommonLib1:74HC595
IC7 = __MyCommonLib1:LM324
IC8 = __MyCommonLib1:7905
IC9 = __MyCommonLib1:LM317
IC10 = __MyCommonLib1:MC34063
J4 J6 J8 J10 J11 J100 R1-R90 R100 = __MyCommonLib1:R
KEY1-KEY3 = __MyCommonLib1:KEY
LI1-LI5 = __MyCommonLib1:KEM5161
Q1 = crystal:CRYSTAL: CRYSTAL; OC_FARNELL: 1666969; OC_NEWARK: unknown
T1 T3-T6 = __MyCommonLib1:BC847
T2 T7 = __MyCommonLib1:BC857
TR1 = __MyCommonLib1:TRANS_3WIND
X1 = __MyCommonLib1:PIN2X3
X2 X3 = con-wago-500:W237-102: WAGO SCREW CLAMP; MPN: 237-102; OC_FARNELL: unknown; OC_NEWARK: 70K9898
X4 = __MyCommonLib1:USB_MICRO
X5 = __MyCommonLib1:USB_TYPE_B
ZD1 ZD2 = __MyCommonLib1:ZENNER